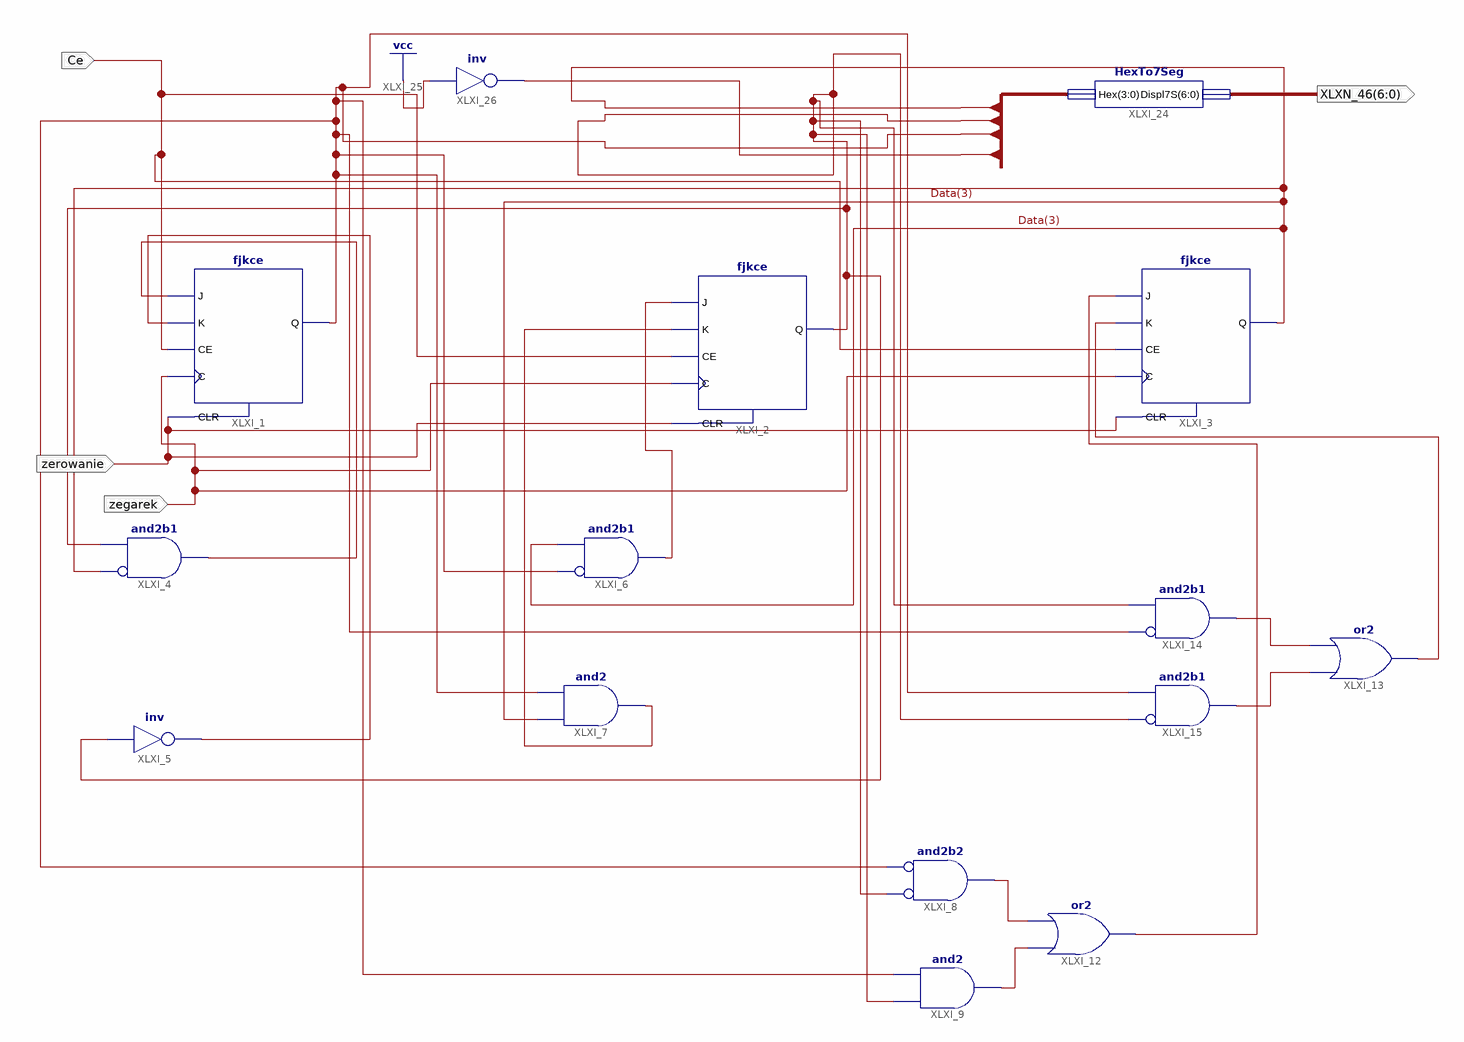
[diagram p0: schematic sheet 1]
// Xilinx ISE schematic liczniik.sch (xc9500xl) as structural Verilog: 15 symbols, 4 ports
module liczniik (
  input  Ce,
  input  zegarek,
  input  zerowanie,
  output [6:0] XLXN_46
);

  wire XLXN_13, XLXN_15, XLXN_18, XLXN_20, XLXN_21, XLXN_22, XLXN_23, XLXN_24, XLXN_25, XLXN_26;
  wire [3:0] Data;

  fjkce XLXI_1 (.C(zegarek), .CE(Ce), .CLR(zerowanie), .J(XLXN_13), .K(XLXN_15), .Q(Data[1]));
  fjkce XLXI_2 (.C(zegarek), .CE(Ce), .CLR(zerowanie), .J(XLXN_18), .K(XLXN_20), .Q(Data[2]));
  fjkce XLXI_3 (.C(zegarek), .CE(Ce), .CLR(zerowanie), .J(XLXN_23), .K(XLXN_26), .Q(Data[3]));
  and XLXI_4 (XLXN_13, ~Data[3], Data[2]);  // and2b1
  not XLXI_5 (XLXN_15, Data[2]);
  and XLXI_6 (XLXN_18, ~Data[1], Data[3]);  // and2b1
  and XLXI_7 (XLXN_20, Data[3], Data[1]);
  and XLXI_8 (XLXN_21, ~Data[2], ~Data[1]);  // and2b2
  and XLXI_9 (XLXN_22, Data[2], Data[1]);
  or XLXI_12 (XLXN_23, XLXN_22, XLXN_21);
  or XLXI_13 (XLXN_26, XLXN_25, XLXN_24);
  and XLXI_14 (XLXN_24, ~Data[1], Data[2]);  // and2b1
  and XLXI_15 (XLXN_25, ~Data[2], Data[1]);  // and2b1
  HexTo7Seg XLXI_24 (.Hex(Data), .Displ7S(XLXN_46));
  not XLXI_26 (Data[0], 1'b1);
endmodule
